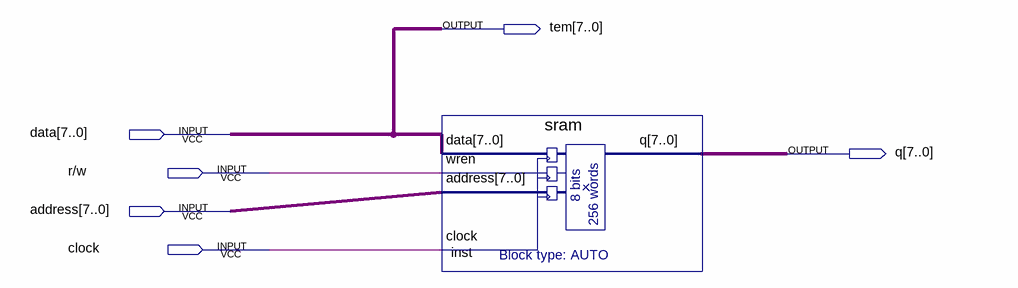
[diagram p0: schematic sheet]
// Quartus schematic experiment8.bdf as structural Verilog: 1 symbols, 6 pins
module experiment8 (
  input  [7:0] data,
  input  \r/w ,
  input  [7:0] address,
  input  clock,
  output [7:0] tem,
  output [7:0] q
);

  sram inst (.data(data), .wren(\r/w ), .address(address), .clock(clock), .q(q));

  assign tem = data;
endmodule
